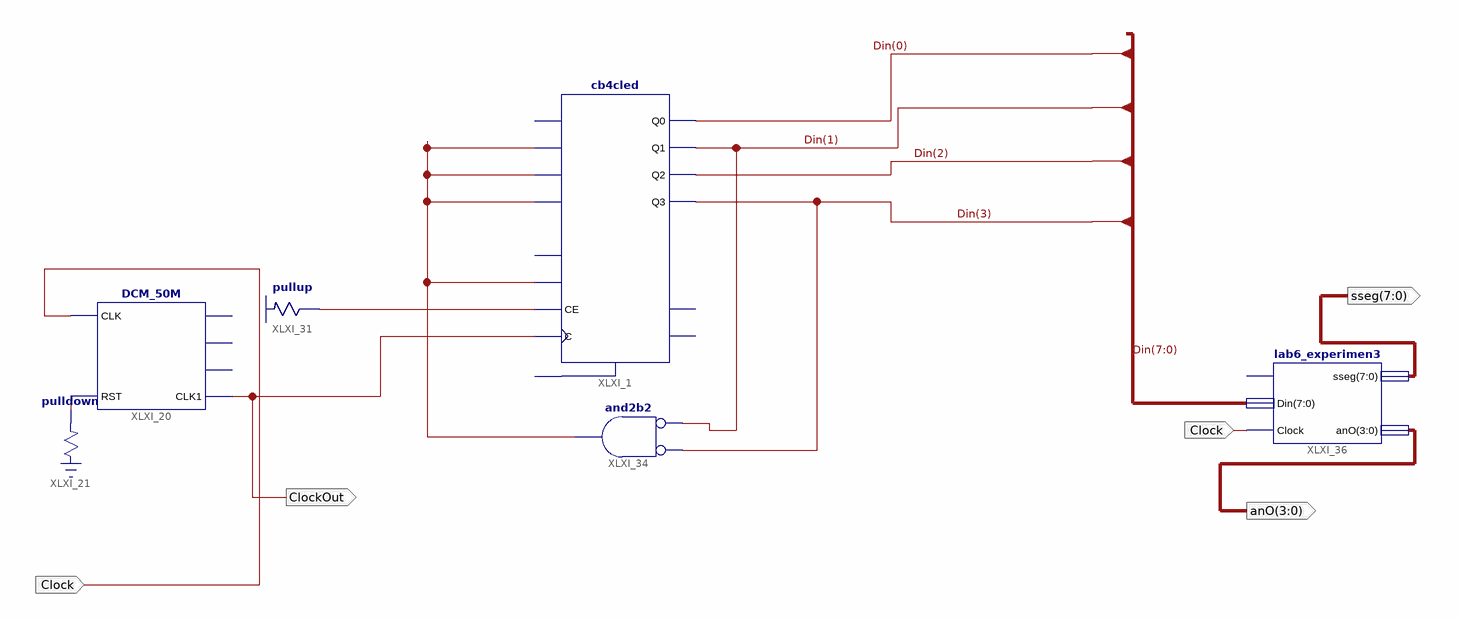
[diagram p0: schematic sheet 1]
// Xilinx ISE schematic lab8_exp6.sch (spartan3e) as structural Verilog: 6 symbols, 4 ports
module lab8_exp6 (
  input  Clock,
  output ClockOut,
  output [7:0] sseg,
  output [3:0] anO
);

  wire XLXN_28, XLXN_30, XLXN_34;
  wire [7:0] Din;

  cb4cled XLXI_1 (
    .C(ClockOut), .CE(XLXN_30), .D1(XLXN_34), .D2(XLXN_34), .D3(XLXN_34), .L(XLXN_34), .Q0(Din[0]),
    .Q1(Din[1]), .Q2(Din[2]), .Q3(Din[3]));  // open: CLR, D0, UP, CEO, TC
  DCM_50M XLXI_20 (.CLK(Clock), .RST(XLXN_28), .CLK1(ClockOut));  // open: CLK1M, CLK10k, CLK1k
  \pulldown  XLXI_21 (.O(XLXN_28));
  \pullup  XLXI_31 (.O(XLXN_30));
  and XLXI_34 (XLXN_34, ~Din[1], ~Din[3]);  // and2b2
  lab6_experimen3 XLXI_36 (.Din(Din), .Clock(Clock), .sseg(sseg), .anO(anO));  // open: En
endmodule
